# EAGLE design uart2dali_mr3020 (EAGLE 6.3)
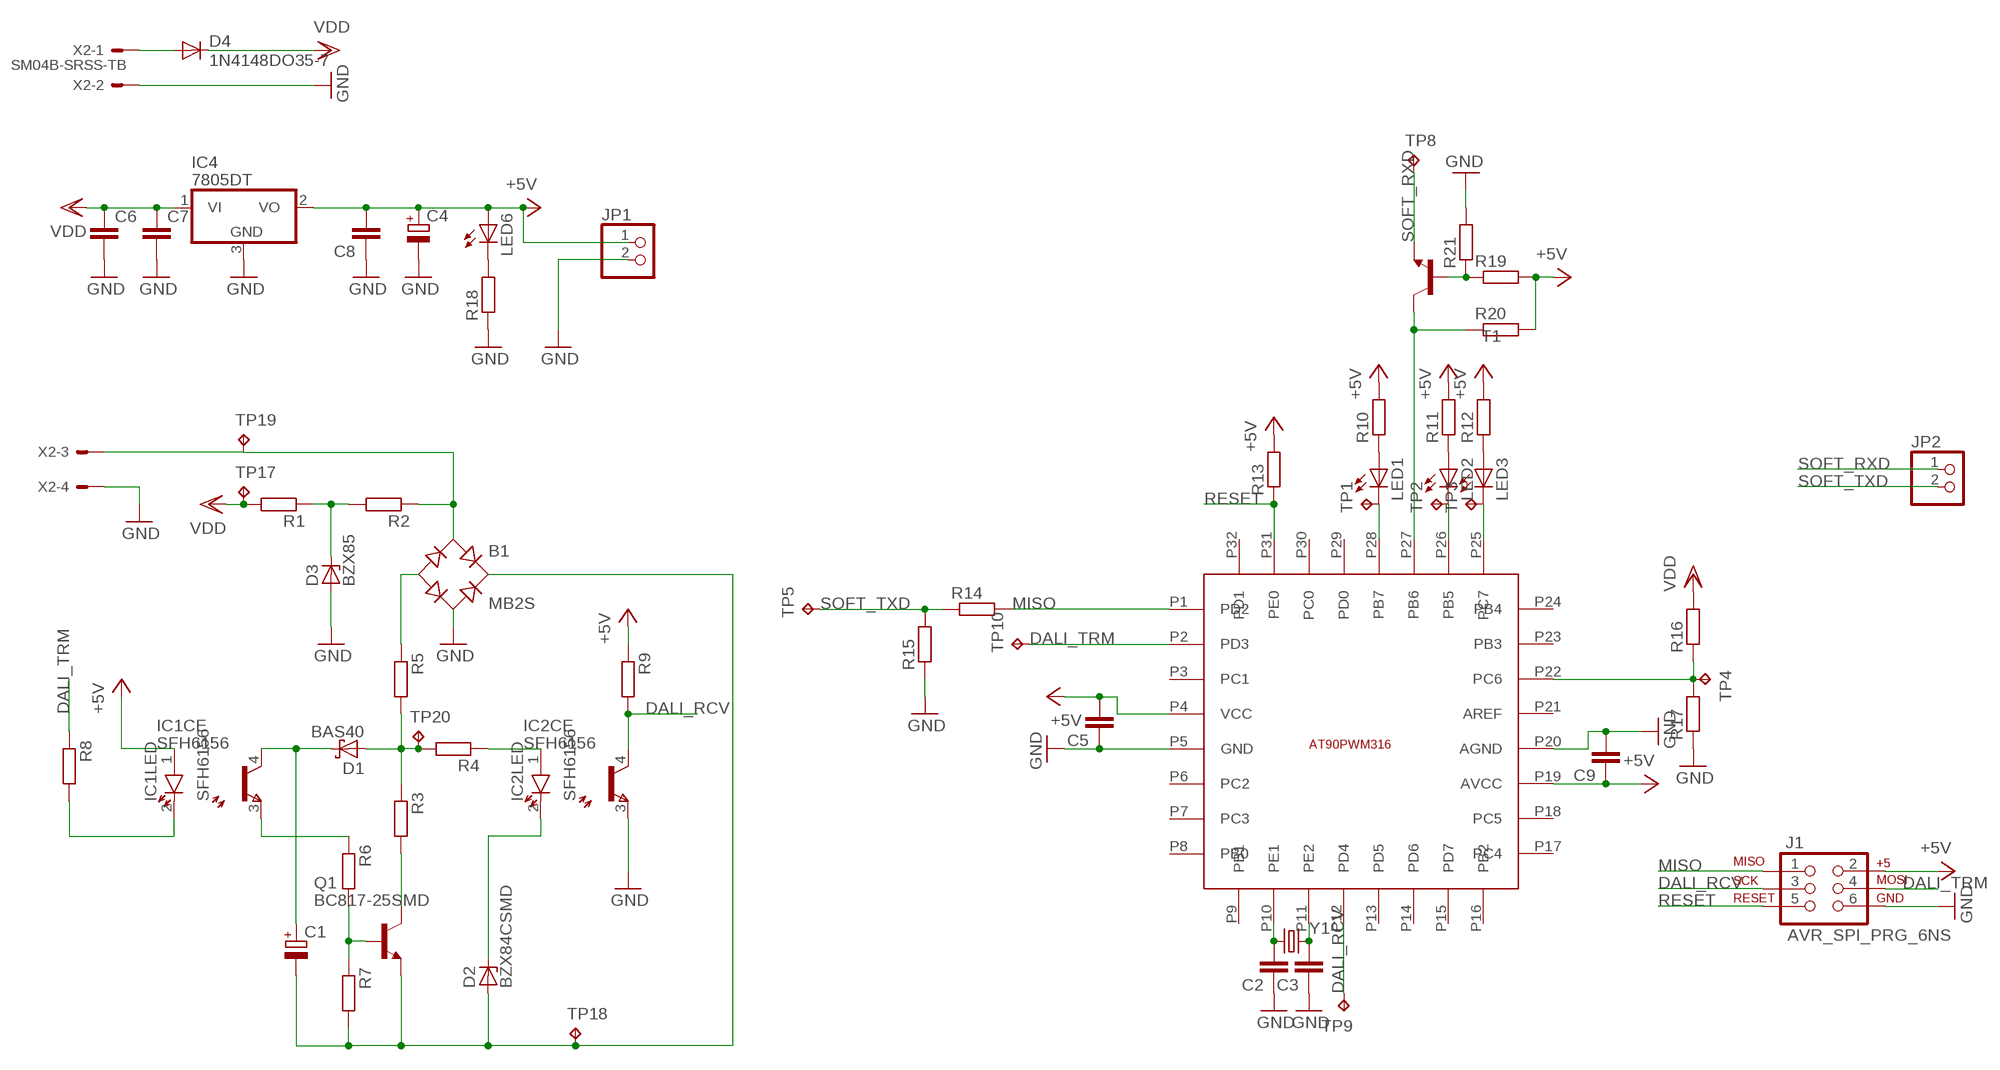
[diagram p0: schematic, sheet 1]

## Parts
B1  MB2S  [SOIC-4]
C1  CPOL-EUCT6032  [CT6032]
C2  C-EUC0603  [C0603]
C3  C-EUC0603  [C0603]
C4  CPOL-EUCT7343  [CT7343]
C5  C-EUC0603  [C0603]
C6  C-EUC0805  [C0805]
C7  C-EUC0805  [C0805]
C8  C-EUC0805  [C0805]
C9  C-EUC0603  [C0603]
D1  BAS40  [SOT23]
D2  BZX84CSMD  [TO236]
D3  BZX85  [DO41Z10]
D4  1N4148DO35-7  [DO35-7]
IC1  SFH6156  [SFH]
IC2  SFH6156  [SFH]
IC4  7805DT  [TO252]
J1  AVR_SPI_PRG_6NS  [2X3-NS]
JP1  PINHD-1X2  [1X02]
JP2  PINHD-1X2  [1X02]
LED1  LEDCHIPLED_0805  [CHIPLED_0805]
LED2  LEDCHIPLED_0805  [CHIPLED_0805]
LED3  LEDCHIPLED_0805  [CHIPLED_0805]
LED6  LEDCHIPLED_0805  [CHIPLED_0805]
Q1  BC817-25SMD  [SOT23-BEC]
R1  R-EU_0204/7  [0204/7]
R2  R-EU_0204/7  [0204/7]
R3  R-EU_R0603  [R0603]
R4  R-EU_R0603  [R0603]
R5  R-EU_R0603  [R0603]
R6  R-EU_R0603  [R0603]
R7  R-EU_R0603  [R0603]
R8  R-EU_R0603  [R0603]
R9  R-EU_R0603  [R0603]
R10  R-EU_R0603  [R0603]
R11  R-EU_R0603  [R0603]
R12  R-EU_R0603  [R0603]
R13  R-EU_R0603  [R0603]
R14  R-EU_R0603  [R0603]
R15  R-EU_R0603  [R0603]
R16  R-EU_R0603  [R0603]
R17  R-EU_R0603  [R0603]
R18  R-EU_R0603  [R0603]
R19  R-EU_R0603  [R0603]
R20  R-EU_R0603  [R0603]
R21  R-EU_R0603  [R0603]
T1  -NPN-SOT23-EBC  [SOT23-EBC]
TP1  TPB1,27  [B1,27]
TP2  TPB1,27  [B1,27]
TP3  TPB1,27  [B1,27]
TP4  TPB1,27  [B1,27]
TP5  TPB1,27  [B1,27]
TP8  TPB1,27  [B1,27]
TP9  TPB1,27  [B1,27]
TP10  TPB1,27  [B1,27]
TP17  TPB1,27  [B1,27]
TP18  TPB1,27  [B1,27]
TP19  TPB1,27  [B1,27]
TP20  TPB1,27  [B1,27]
U$1  AT90PWM316  [QFN32_7MM]
X2  SM04B-SRSS-TB  [SM04B-SRSS-TB]
Y1  CRYSTALTXC-7A  [CRYSTAL-TXC-7A]

## Nets
+5V: C4.+ C5.2 C8.2 C9.1 IC1.1(LED:A) IC4.2(VO) J1.2 JP1.1 LED6.A R9.1 R10.2 R11.2 R12.2 R13.2 R19.2 R20.2 U$1.P4(VCC) U$1.P19(AVCC)
DALI_RCV: IC2.4(CE:C) J1.3 R9.2 TP9.TP U$1.P12(PD4)
DALI_TRM: J1.4 R8.1 TP10.TP U$1.P2(PD3)
GND: B1.~2(AC2) C2.1 C3.1 C4.- C5.1 C6.2 C7.2 C8.1 C9.2 D3.A IC2.3(CE:E) IC4.3(GND) J1.6 JP1.2 R15.1 R17.1 R18.1 R21.2 U$1.P5(GND) U$1.P20(AGND) X2.2 X2.4
MISO: J1.1 R14.2 U$1.P1(PD2)
N$1: IC1.2(LED:K) R8.2
N$2: B1.~1(AC1) R2.1 TP19.TP X2.3
N$3: D3.C R1.1 R2.2
N$4: C1.+ D1.3(C) IC1.4(CE:C)
N$5: IC1.3(CE:E) R6.1
N$6: Q1.B R6.2 R7.1
N$7: B1.+ C1.- D2.A Q1.E R7.2 TP18.TP
N$8: LED1.A R10.1
N$9: D1.1(A) R3.1 R4.2 R5.2 TP20.TP
N$10: Q1.C R3.2
N$11: IC2.1(LED:A) R4.1
N$12: D2.C IC2.2(LED:K)
N$13: B1.- R5.1
N$14: LED2.A R11.1
N$15: LED3.A R12.1
N$16: C2.2 U$1.P10(PE1) Y1.P$1
N$19: C3.2 U$1.P11(PE2) Y1.P$2
N$20: R19.1 R21.1 T1.B
N$21: R20.1 T1.C U$1.P27(PB6)
N$23: D4.A X2.1
N$27: LED3.C TP3.TP U$1.P25(PC7)
N$28: LED2.C TP2.TP U$1.P26(PB5)
N$29: LED1.C TP1.TP U$1.P28(PB7)
N$30: R16.1 R17.2 TP4.TP U$1.P22(PC6)
N$32: LED6.C R18.2
RESET: J1.5 R13.1 U$1.P31(PE0)
SOFT_RXD: JP2.1 T1.E TP8.TP
SOFT_TXD: JP2.2 R14.1 R15.2 TP5.TP
VDD: C6.1 C7.1 D4.C IC4.1(VI) R1.2 R16.2 TP17.TP
Unconnected: U$1.P3(PC1) U$1.P6(PC2) U$1.P7(PC3) U$1.P8(PB0) U$1.P9(PB1) U$1.P13(PD5) U$1.P14(PD6) U$1.P15(PD7) U$1.P16(PB2) U$1.P17(PC4) U$1.P18(PC5) U$1.P21(AREF) U$1.P23(PB3) U$1.P24(PB4) U$1.P29(PD0) U$1.P30(PC0) U$1.P32(PD1)

## Library data of the parts
B1 = rectifier:MB*S: Bridge Rectifier Source: http://www.fairchildsemi.com/ds/MB/MB6S.pdf
C1 C4 = resistor:CPOL-EU: POLARIZED CAPACITOR, European symbol
C2 C3 C5-C9 = resistor:C-EU: CAPACITOR, European symbol
D1 = diode:BAS40: Silicon Schottky Diodes General-purpose diode for high-speed switching
D2 = diode:BZX84CSMD: Z DIODE
D3 = diode:BZX85: Z DIODE
D4 = diode:1N4148: DIODE high speed (Philips)
IC1 IC2 = optocoupler:SFH6156: 5.3 kV TRIOS High Reliability Optocoupler; MF: VISHAY/TELEFUNKEN; MPN: SFH6156-4T; OC_FARNELL: 1612479; OC_NEWARK: 21H7733
IC4 = linear:78*: Positive VOLTAGE REGULATOR Source: http://cache.national.com/ds/LM/LM78L05.pdf http://www.fairchildsemi.com/ds/LM/LM7805.pdf
J1 = SparkFun-Connectors:AVR_SPI_PRG_6: AVR ISP 6 Pin This is the reduced ISP connector for AVR programming. Common on Arduino. This footprint will take up less PCB space and can be used with a 10-pin to 6-pin adapter such as SKU: BOB-08508
JP1 JP2 = pinhead:PINHD-1X2: PIN HEADER
LED1-LED3 LED6 = led:LED: LED OSRAM: - CHIPLED LG R971, LG N971, LY N971, LG Q971, LY Q971, LO R971, LY R971 LH N974, LH R974 LS Q976, LO Q976, LY Q976 LO Q996 - Hyper CHIPLED LW Q18S LB Q993, LB Q99A, LB R99A - SideLED LS A670, LO A670, LY A670, LG A670, LP A670 LB A673, LV A673, LT A673, LW A673 LH A674 LY A675 LS A676, LA A676, LO A676, LY A676, LW A676 LS A679, LY A679, LG A679 - Hyper Micro SIDELED® LS Y876, LA Y876, LO Y876, LY Y876 LT Y87S - SmartLED LW L88C, LW L88S LB L89C, LB L89S, LG L890 LS L89K, LO L89K, LY L89K LS L896, LA L896, LO L896, LY L896 - TOPLED LS T670, LO T670, LY T670, LG T670, LP T670 LSG T670, LSP T670, LSY T670, LOP T670, LYG T670 LG T671, LOG T671, LSG T671 LB T673, LV T673, LT T673, LW T673 LH T674 LS T676, LA T676, LO T676, LY T676, LB T676, LH T676, LSB T676, LW T676 LB T67C, LV T67C, LT T67C, LS T67K, LO T67K, LY T67K, LW E67C LS E67B, LA E67B, LO E67B, LY E67B, LB E67C, LV E67C, LT E67C LW T67C LS T679, LY T679, LG T679 LS T770, LO T770, LY T770, LG T770, LP T770 LB T773, LV T773, LT T773, LW T773 LH T774 LS E675, LA E675, LY E675, LS T675 LS T776, LA T776, LO T776, LY T776, LB T776 LHGB T686 LT T68C, LB T68C - Hyper Mini TOPLED® LB M676 - Mini TOPLED Santana® LG M470 LS M47K, LO M47K, LY M47K Source: http://www.osram.convergy.de LUXEON: - LUMILED® LXK2-PW12-R00, LXK2-PW12-S00, LXK2-PW14-U00, LXK2-PW14-V00 LXK2-PM12-R00, LXK2-PM12-S00, LXK2-PM14-U00 LXK2-PE12-Q00, LXK2-PE12-R00, LXK2-PE12-S00, LXK2-PE14-T00, LXK2-PE14-U00 LXK2-PB12-K00, LXK2-PB12-L00, LXK2-PB12-M00, LXK2-PB14-N00, LXK2-PB14-P00, LXK2-PB14-Q00 LXK2-PR12-L00, LXK2-PR12-M00, LXK2-PR14-Q00, LXK2-PR14-R00 LXK2-PD12-Q00, LXK2-PD12-R00, LXK2-PD12-S00 LXK2-PH12-R00, LXK2-PH12-S00 LXK2-PL12-P00, LXK2-PL12-Q00, LXK2-PL12-R00 Source: www.luxeon.com KINGBRIGHT: KA-3528ASYC Source: www.kingbright.com
Q1 = transistor-npn:BC817*: NPN Transistor
R1-R21 = resistor:R-EU_: RESISTOR, European symbol
T1 = transistor:*-NPN-: NPN Transistror BF959 corrected 2008.03.06
TP1-TP5 TP8-TP10 TP17-TP20 = testpad:TP: Test pad
U$1 = at90pwm316:AT90PWM316
X2 = con-jst2:?M04B-SRSS-TB: Disconnectable Crimp style connector, 1.0mm pitch 4 contacts
Y1 = SparkFun-FreqCtrl:CRYSTAL: Various standard crystals. Proven footprints. Spark Fun Electronics SKU : COM-00534

## Board
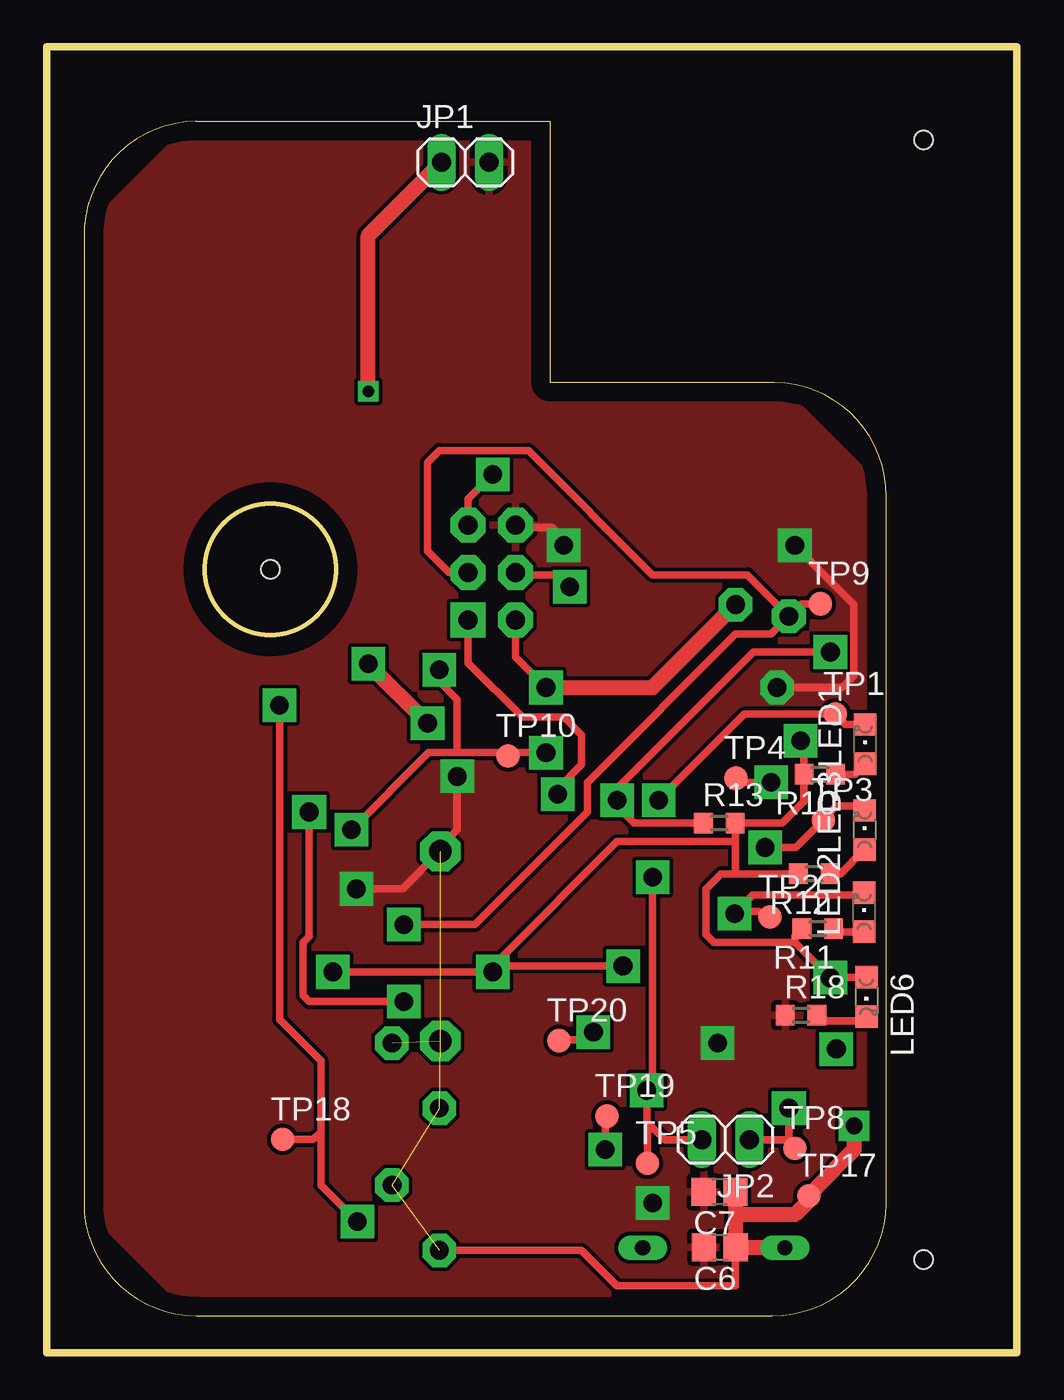
[diagram p1: board, top side]
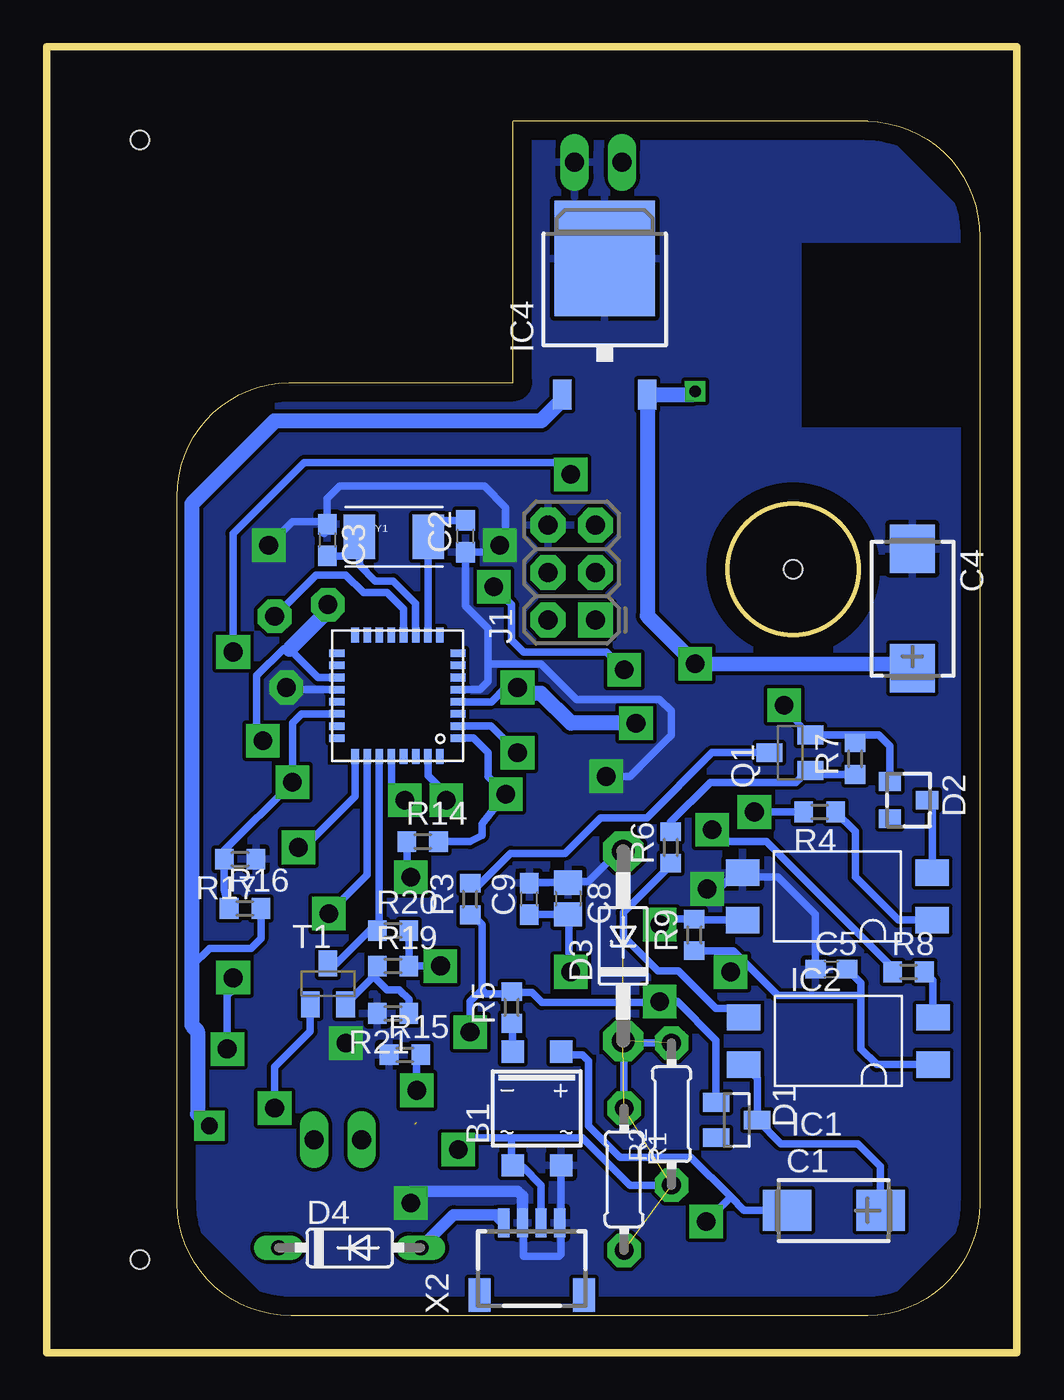
[diagram p2: board, bottom side, seen from below]

Size 52 x 70 mm. Coordinates in mm from the lower left corner, seen from the top.
Outline: 8,66 arc90 2,59.8 2,8 arc90 8,2 38.9,2 arc90 45,8 45,45.9 arc90 39,52 27,52 27,66 8,66
Outline: 0,0 52,0 52,70 0,70 0,0
Outline: circle at 12,42 radius 3.5
Copper layers (1*16): Top 0.035mm / dielectric 1.5mm / Bottom 0.035mm
Design rules "default *": minimum track width 10mil, minimum drill 24mil, track to track 8mil, track to pad 8mil, pad to pad 8mil, via to via 8mil, smd to smd 8mil, copper to edge 40mil, drill to drill 8mil, minimum pad ring 10mil, minimum via ring 8mil, stop-mask expansion 4mil, vias tented up to drill 0mil, thermal gap 10mil
Holes 1 mm at 47,65 47,5 12,42
bRestrict: area 29.6,31.5 to 36.9,38.8; area 2,49.6 to 11.5,59.5

### Footprints (pad centres in the part's own frame; a part is rotated, then mirrored left to right if it is on the bottom)
SOIC-4 = smd 1.2 x 1.2: + 1.3,3.05; - -1.3,3.05; ~1 -1.3,-3.05; ~2 1.3,-3.05
CT6032 = smd 2.6 x 2.2: + 2.5,0; - -2.5,0
C0603 = smd 1.1 x 1: 1 -0.85,0; 2 0.85,0
CT7343 = smd 2.6 x 2.4: + 3.2,0; - -3.2,0
C0805 = smd 1.3 x 1.5: 1 -0.85,0; 2 0.85,0
SOT23 = smd 1 x 1.4: 1 -0.95,-1.1; 2 0.95,-1.1; 3 0,1.1
TO236 = smd 1 x 1.2: A -1,-1; C 0,1; NC 1,-1
DO41Z10 = drill 1.118: A 5.08,0; C -5.08,0
DO35-7 = drill 0.813 long: A 3.81,0; C -3.81,0
SFH = smd 1.4 x 1.8: 1 1.27,5.08; 2 -1.27,5.08; 3 -1.27,-5.08; 4 1.27,-5.08
TO252 = smd 1 x 1.6: 1 -2.28,-4.8; 2 2.28,-4.8 | smd 5.4 x 6.2: 3 0,2.5
2X3-NS = drill 1.016 pad 1.88 square: 1 -2.54,-1.27 | drill 1.016 pad 1.88 octagon: 2 -2.54,1.27; 3 0,-1.27; 4 0,1.27; 5 2.54,-1.27; 6 2.54,1.27
1X02 = drill 1.016 long: 1 -1.27,0; 2 1.27,0
CHIPLED_0805 = smd 1.2 x 1.2: A 0,-1.05; C 0,1.05
SOT23-BEC = smd 1 x 1.4: B -0.95,-1.1; C 0,1.1; E 0.95,-1.1
0204/7 = drill 0.813 octagon: 1 -3.81,0; 2 3.81,0
R0603 = smd 1 x 1.1: 1 -0.85,0; 2 0.85,0
SOT23-EBC = smd 1 x 1.4: B 0.95,-1.1; C 0,1.1; E -0.95,-1.1
B1,27 = smd 1.27 x 1.27: TP 0,0
QFN32_7MM = smd 0.813 x 0.406: P1 -3.25,2.275; P2 -3.25,1.625; P3 -3.25,0.975; P4 -3.25,0.325; P5 -3.25,-0.325; P6 -3.25,-0.975; P7 -3.25,-1.625; P8 -3.25,-2.275; P17 3.25,-2.275; P18 3.25,-1.625; P19 3.25,-0.975; P20 3.25,-0.325; P21 3.25,0.325; P22 3.25,0.975; P23 3.25,1.625; P24 3.25,2.275 | smd 0.406 x 0.813: P9 -2.275,-3.25; P10 -1.625,-3.25; P11 -0.975,-3.25; P12 -0.325,-3.25; P13 0.325,-3.25; P14 0.975,-3.25; P15 1.625,-3.25; P16 2.275,-3.25; P25 2.275,3.25; P26 1.625,3.25; P27 0.975,3.25; P28 0.325,3.25; P29 -0.325,3.25; P30 -0.975,3.25; P31 -1.625,3.25; P32 -2.275,3.25
SM04B-SRSS-TB = smd 0.6 x 1.55: 1 -1.5,2.975; 2 -0.5,2.975; 3 0.5,2.975; 4 1.5,2.975 | smd 1.2 x 1.8: FIT@1 -2.8,-0.9; FIT@2 2.8,-0.9
CRYSTAL-TXC-7A = smd 1.7 x 2.4: P$1 1.85,0; P$2 -1.85,0

### Placement (x,y rotation side)
B1  25.73,13.1 0 bottom
C1  9.81,7.63 0 bottom
C2  29.55,43.76 90 bottom
C3  36.96,43.56 270 bottom
C4  5.6,39.88 270 bottom
C5  9.94,20.55 0 bottom
C6  36.08,5.65 180 top
C7  36.06,8.63 180 top
C8  24.05,24.35 270 bottom
C9  26.13,24.32 90 bottom
D1  15.02,12.48 270 bottom
D2  5.81,29.62 270 bottom
D3  21.1,21.81 90 bottom
D4  35.76,5.63 0 bottom
IC1  9.57,16.72 270 bottom
IC2  9.62,24.46 270 bottom
IC4  22.09,56.15 0 bottom
J1  23.86,41.81 90 bottom
JP1  22.43,63.8 0 top
JP2  36.39,11.43 180 top
LED1  43.87,32.62 0 top
LED2  43.81,23.62 0 top
LED3  43.84,28.02 0 top
LED6  43.94,19.08 180 top
Q1  12.16,32.16 90 bottom
R1  21.05,9.3 270 bottom
R2  18.51,12.79 90 bottom
R3  29.3,24.32 90 bottom
R4  10.57,28.99 180 bottom
R5  27.08,18.51 90 bottom
R6  18.56,27.08 90 bottom
R7  8.67,31.84 90 bottom
R8  5.81,20.41 0 bottom
R9  17.29,22.4 90 bottom
R10  41.44,31 180 top
R11  41.33,22.73 180 top
R12  41.14,25.67 180 top
R13  36.05,28.39 0 top
R14  31.84,27.4 0 bottom
R15  32.8,15.97 0 bottom
R16  41.37,23.82 0 bottom
R17  41.63,26.46 180 bottom
R18  40.44,18.1 0 top
R19  33.43,20.73 0 bottom
R20  33.43,22.64 0 bottom
R21  33.43,18.19 180 bottom
T1  36.92,19.78 0 bottom
TP1  42.26,34.23 0 top
TP2  38.77,23.36 0 top
TP3  41.63,28.55 0 top
TP4  36.93,30.8 0 top
TP5  32.19,10.15 0 top
TP8  40.12,10.96 0 top
TP9  41.46,40.14 0 top
TP10  24.71,31.98 0 top
TP17  40.85,8.41 0 top
TP18  12.65,11.43 0 top
TP19  30.02,12.69 0 top
TP20  27.45,16.73 0 top
U$1  33.2,35.22 180 bottom
X2  26,4 0 bottom
Y1  33.39,43.74 0 bottom

### Tracks (layer width: path | path; a pad name or v marks a point on that pad's centre or on a via)
+5V  (via drill 0.6, 1)
  Top 0.406: v23.91,20.41 v15.34,20.41 | LED6.A 41.98,20.13 | 41.98,20.13 40.1,22 | 40.1,22 37,22 35.75,22 35.34,22.41 35.34,24.86 36.15,25.67 36.92,25.67 | v23.91,20.41 24,20.51 24.32,20.92 24.32,21.14 30.57,27.4 36.92,27.4 | R13.2 36.97,28.39 | 40.1,22 40.1,22.36 R11.2 | R12.2 36.92,25.67 | 36.97,28.39 39.42,28.39 40.59,29.56 R10.2 40.59,32.65 v40.42,32.8 | 36.97,28.39 36.92,28.35 36.92,27.4 | 36.92,27.4 36.92,25.67 | J1.2 25.13,37.29 v26.77,35.66 | 41.98,20.13 v42.01,20.1 | v30.89,20.73 24.23,20.73 v23.91,20.41
  Top 0.813: v26.77,35.66 32.48,35.66 v36.92,40.1 | v17.24,36.92 v20.41,33.75 | v17.24,51.53 17.24,59.88 JP1.1
  Bottom 0.406: IC1.1 7.51,15.45 8.35,16.29 8.35,19.14 | 8.35,19.14 8.35,19.82 C5.2 | R9.1 15.2,21.55 14.7,21.05 | 14.7,21.05 12.79,19.14 8.35,19.14 | C9.1 26.1,23.5 C8.2 24,23.45 24,20.51 v23.91,20.41 | v15.34,20.41 14.7,21.05 | U$1.P4 28.16,34.89 27.4,35.66 v26.77,35.66 | U$1.P19 37.46,36.19 38.99,37.72 39.31,37.72 40.73,36.29 40.73,33.11 v40.42,32.8 | v42.01,20.1 42.01,19.46 42.32,19.14 v42.32,16.29 | R20.2 R19.2 v30.89,20.73
  Bottom 0.813: v36.92,40.1 36.92,39.78 38.99,37.72 | v20.41,33.75 23.91,33.75 25.5,35.34 26.45,35.34 v26.77,35.66 | 5.17,37.17 C4.+ 5.6,36.89 5.53,36.89 v17.24,36.92 19.81,39.5 IC4.2 17.42,51.35 v17.24,51.53
DALI_RCV  (via drill 1)
  Top 0.406: v19.14,22.95 22.95,22.95 28.99,28.99 28.99,30.57 36.92,38.51 38.83,38.51 v39.78,39.47 | TP9.TP 40.46,40.14 v39.78,39.47 | J1.3 21.56,41.81 20.41,42.96 20.41,47.72 21.05,48.35 25.81,48.35 32.48,41.69 37.56,41.69 v39.78,39.47
  Bottom 0.406: IC2.4 17.23,23.19 R9.2 18.85,23.25 v19.14,22.95 | v39.78,39.47 37.56,41.69 35.97,41.69 35.02,40.73 33.75,40.73 32.87,39.85 U$1.P12
DALI_TRM  (via drill 1)
  Top 0.406: v16.34,28.04 20.46,32.16 22,32.16 | 22,32.16 24.26,32.16 TP10.TP | 25.18,32.13 TP10.TP | v26.77,32.16 24.89,32.16 TP10.TP | v21.05,36.61 21.05,35.97 22,35.02 22,32.16 | v28.04,41.05 27.4,41.69 25.26,41.69 J1.4
  Bottom 0.406: R8.1 6.66,20.63 13.43,27.4 15.7,27.4 v16.34,28.04 | U$1.P2 28.19,33.59 v26.77,32.16 | v21.05,36.61 22,37.56 26.45,37.56 27.08,38.2 27.08,40.1 v28.04,41.05
GND  (via drill 1)
  Top 0.406: 35.23,5.28 C6.2 35.22,5.63 | v16.61,24.86 19.07,24.86 D3.A 21.05,26.94 21.05,27.08 22,28.04 v22,30.89 | v39.15,35.66 42.64,35.66 43.27,36.29 43.27,40.1 v40.1,43.27 | v27.72,43.27 27.72,43.59 27.08,44.23 25.26,44.23 J1.6
  Bottom 0.406: X2.4 24.43,7.05 B1.~2 24.43,5.29 24.54,5.17 26.45,5.17 26.45,6.92 X2.2 | v32.48,8.03 32.48,8.67 | C5.1 10.79,23.49 12.79,25.5 14.46,25.5 IC2.3 15.1,25.73 15.97,24.86 v16.61,24.86 | D3.A 21.1,27.13 22.95,25.27 23.98,25.27 C8.1 26.1,25.2 C9.2 26.3,25 | U$1.P5 28.79,35.54 28.35,35.97 28.35,36.92 | 28.35,36.92 25.5,36.92 23.59,35.02 19.14,35.02 18.51,34.38 18.51,33.11 20.73,30.89 v22,30.89 | C3.1 36.96,45.78 36.29,46.45 28.54,46.45 27.4,45.31 27.4,43.59 v27.72,43.27 28.09,42.91 C2.1 29.55,40.02 28.35,38.83 28.35,36.92 | 37.14,43.91 C3.1 | U$1.P20 38.95,35.54 v39.15,35.66 | v40.1,43.27 38.83,44.55 37.41,44.55 C3.1
  Bottom 0.61: X2.2 26.5,8.4 26.77,8.67 32.48,8.67
  other vias: 35.97,16.61
  pour Top: 2,8 8,2 39,2 45,8 45,46 39,52 27,52 27,66 8,66 2,60
  pour Bottom: 2,8 8,2 39,2 45,8 45,46 39,52 27,52 27,66 8,66 2,60
MISO  (via drill 1)
  Top 0.406: J1.1 22.59,36.97 25.5,34.07 27.72,34.07 28.67,33.11 28.67,31.53 27.4,30.26 v27.4,29.94
  Bottom 0.406: U$1.P1 29.13,32.94 28.35,32.16 28.35,30.89 v27.4,29.94 28.67,28.35 28.67,27.72 29.3,27.4 R14.2
N$1
  Bottom 0.406: IC1.2 4.49,19.95 R8.2
N$2  (via drill 1)
  Top 0.406: v29.94,10.89 29.94,12.61 TP19.TP
  Bottom 0.406: X2.3 25.5,8.98 26.45,9.94 26.77,9.94 B1.~1 27.08,9.79 27.08,11.53 | R2.1 20.73,8.98 23.27,11.53 27.08,11.53 | 27.08,11.53 29.3,11.53 v29.94,10.89
N$3
  Bottom 0.406: R2.2 20.97,16.61 D3.C 21.05,16.69 R1.1
N$4
  Bottom 0.406: IC1.4 13.92,14.71 D1.3 12.65,11.21 8.53,11.21 7.31,9.99 C1.+
N$5
  Bottom 0.406: R6.1 18.45,26.23 21.1,23.59 21.1,22.32 19.24,20.46 18.13,20.46 16.13,18.46 15.46,18.46 15,18 IC1.3
N$6
  Bottom 0.406: R6.2 18.56,28.44 16.43,30.57 14.38,30.57 11.84,30.58 11.38,31.04 Q1.B 10.84,31 R7.1
N$7  (via drill 1)
  Top 0.406: v12.48,34.7 12.48,17.88 14.7,15.65 14.7,11.84 | 14.7,11.84 14.7,8.98 v16.65,7.03 | TP18.TP 14.29,11.43 14.7,11.84
  Bottom 0.406: 15.34,8.35 14.62,7.63 C1.- | 15.34,8.35 17.48,10.49 21.29,10.49 22.95,12.16 22.95,15.65 23.27,15.97 24.29,15.97 B1.+ | D2.A 6.81,32.53 7.4,33.11 8.67,33.11 | 8.67,33.11 10.11,33.11 Q1.E 11.21,33.11 v12.48,34.7 | R7.2 8.67,33.11 | v16.65,7.03 15.34,8.35
N$8
  Top 0.406: R10.1 43.3,31 LED1.A
N$9  (via drill 1)
  Top 0.406: v14.06,28.99 14.06,22.32 13.75,22 13.75,19.14 14.06,18.83 v19.14,18.83 | v29.3,17.19 28.99,16.78 27.5,16.78 TP20.TP
  Bottom 0.406: D1.1 16.12,16.75 18.19,18.83 v19.14,18.83 19.41,18.78 25.46,18.78 26,19.32 27.04,19.32 R5.2 27.08,19.25 28.45,19.25 28.67,19.46 | R4.2 v14.06,28.99 | R3.1 29.3,23.59 28.67,22.95 28.67,19.46 | 28.67,19.46 29.3,18.83 v29.3,17.19
N$10
  Bottom 0.406: R3.2 28.99,24.91 27.13,26.77 24.23,26.77 22.32,28.67 19.83,28.67 16.34,32.16 Q1.C
N$11
  Bottom 0.406: IC2.1 6.36,23.19 8.67,25.5 8.67,27.93 R4.1
N$12
  Bottom 0.406: IC2.2 4.54,29.35 D2.C
N$13
  Bottom 0.406: B1.- 27.03,17.61 R5.1
N$14
  Top 0.406: R11.1 42.34,22.57 LED2.A
N$15
  Top 0.406: R12.1 42.54,25.67 LED3.A
N$16
  Bottom 0.406: C2.2 30.67,44.6 Y1.P$1 31.57,41.8 U$1.P10
N$17  (via drill 1, 1.2)  (5 unrouted)
  other vias: 18.51,16.61 18.51,8.98 21.05,5.49 21.05,13.11 21.1,16.71 21.1,26.87
N$19
  Bottom 0.406: C3.2 35.95,42.71 Y1.P$2 35.24,42.23 34.38,41.37 33.43,41.37 32.22,40.16 U$1.P11
N$20
  Bottom 0.406: R19.1 34.28,20.37 34.47,20.18 | 34.47,20.18 T1.B | R21.1 32.58,18.93 33.11,19.46 33.75,19.46 34.47,20.18
N$21
  Bottom 0.406: U$1.P27 34.17,23.16 R20.1 34.7,22.64 36.46,20.88 T1.C
N$23
  Bottom 0.61: X2.1 27.92,7.4 30.18,7.4 D4.A
N$27  (via drill 1)
  Top 0.406: v38.51,27.08 40.16,27.08 TP3.TP 41.63,28.61 42.32,29.3 43.6,29.3 LED3.C
  Bottom 0.406: U$1.P25 35.47,29.81 38.2,27.08 v38.51,27.08
N$28  (via drill 1)
  Top 0.406: LED2.C 43.68,24.54 37.86,24.54 37.32,24 37,23.66 | 37,23.66 v36.88,23.54 | 37,23.66 38.14,23.66 TP2.TP
  Bottom 0.406: U$1.P26 34.82,25.6 v36.88,23.54
N$29  (via drill 1)
  Top 0.406: LED1.C 42.82,33.67 TP1.TP 37.41,34.23 v32.8,29.62
  Bottom 0.406: U$1.P28 33.52,30.34 v32.8,29.62
N$30  (via drill 1)
  Top 0.406: 36.83,30.8 TP4.TP 37.35,30.57 v38.83,30.57
  Bottom 0.406: R16.1 42.48,24.83 R17.2 42.48,26.92 v38.83,30.57 38.83,33.75 38.34,34.24 U$1.P22
N$32
  Top 0.406: R18.2 41.37,18.19 41.78,17.78 43.69,17.78 LED6.C
RESET  (via drill 1)
  Top 0.406: R13.1 31.48,28.39 30.57,29.3 v30.57,29.62 30.57,30.26 37.88,37.56 v42.01,37.56 | v23.91,47.09 22.59,45.77 J1.5
  Bottom 0.406: U$1.P31 31.57,30.93 30.57,29.94 v30.57,29.62 | v42.01,37.56 42.01,43.91 38.2,47.72 24.54,47.72 v23.91,47.09
SOFT_RXD  (via drill 1)
  Top 0.406: v39.78,13.11 39.78,11.3 TP8.TP 39.65,11.43 JP2.1
  Bottom 0.406: v39.78,13.11 39.78,15.34 37.88,17.24 37.88,18.04 T1.E
SOFT_TXD  (via drill 1)  (1 unrouted)
  Top 0.406: v32.48,25.5 32.48,14.38 v32.16,14.06 32.16,12.35 33.15,11.43 JP2.2 | TP5.TP 32.19,12.22 32.25,12.27
  Bottom 0.406: R14.1 32.7,25.91 v32.48,25.5 | v32.16,14.06 32.16,15.76 R15.2
VDD  (via drill 0.9)
  Top 0.406: 39.23,5.65 D4.C | 36.91,5.63 C6.1 36.92,5.33 36.92,3.59 30.57,3.59 28.67,5.49 R1.2 | TP17.TP 40.85,8.15 | 36.95,7.4 C7.1
  Top 0.813: C6.1 39.23,5.65 | C7.1 36.91,5.63 | TP17.TP 42.7,10.32 43.27,10.89 v43.27,12.16 | 40.85,8.15 40.1,7.4 36.95,7.4
  Bottom 0.406: R16.2 40.52,22.22 41.05,21.68 43.27,21.68 44.23,20.73
  Bottom 0.813: v43.27,12.16 43.91,12.79 43.91,17.24 44.23,17.56 44.23,20.73 44.23,45.5 39.78,49.94 25.5,49.94 24.37,51.06 IC4.1